# Altium schematic sheet VoltageReferenceGen.SchDoc
size A
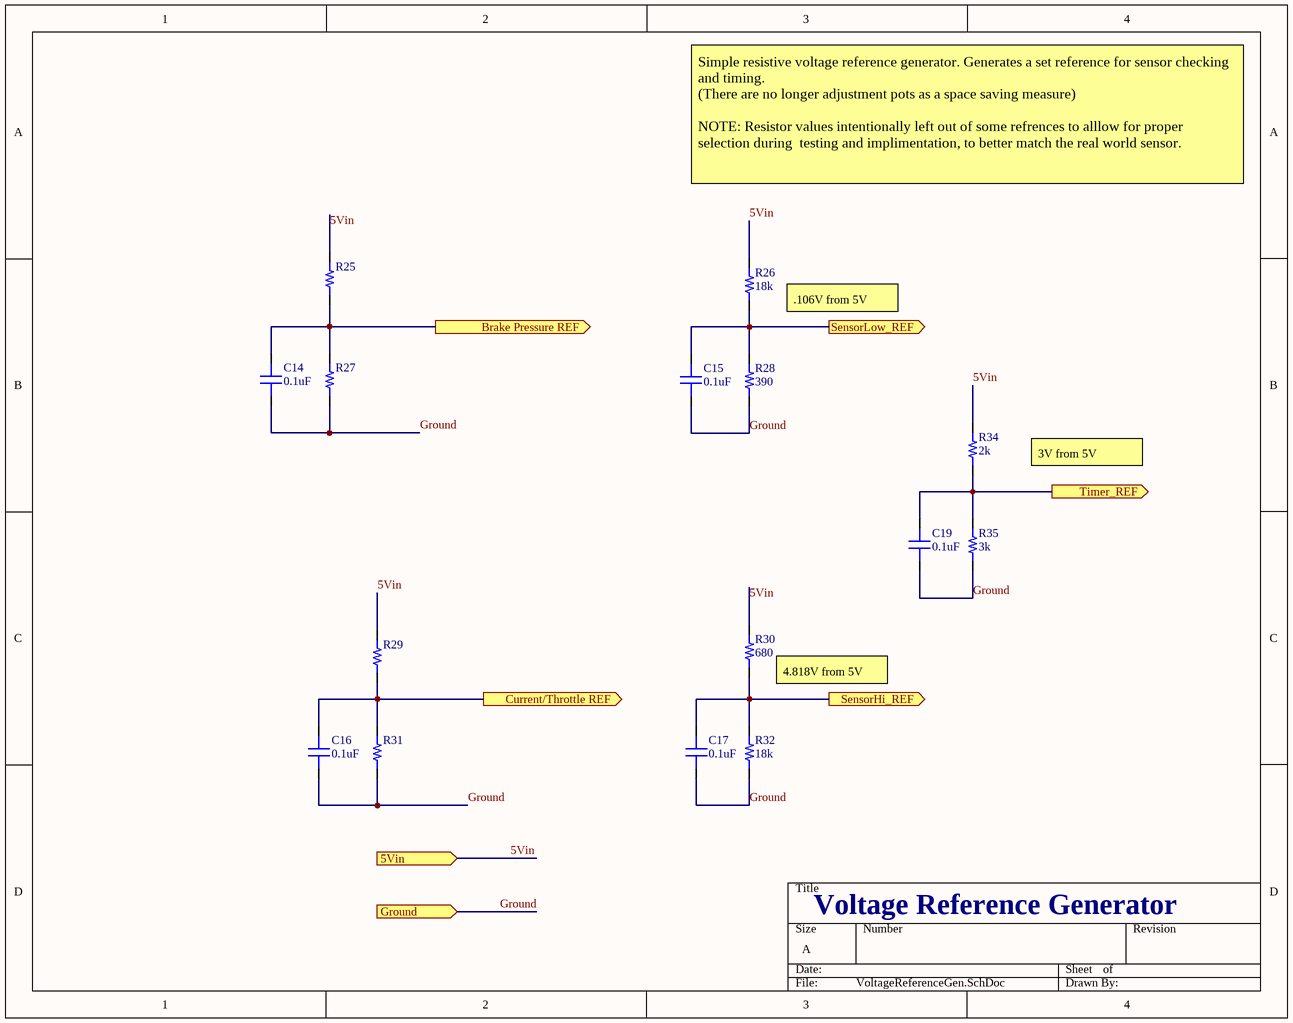
[diagram p0: VoltageReferenceGen.SchDoc]

## Parts
C14  capacitance: 0.1uF  [0603]  (hidden comment: capacitor)
C15  capacitance: 0.1uF  [0603]  (hidden comment: capacitor)
C16  capacitance: 0.1uF  [0603]  (hidden comment: capacitor)
C17  capacitance: 0.1uF  [0603]  (hidden comment: capacitor)
C19  capacitance: 0.1uF  [0603]  (hidden comment: capacitor)
R25  resistor  [RES 0603/1608]  (value not drawn)
R26  resistance: 18k  [RES 0603/1608]  (hidden comment: resistor)
R27  resistor  [RES 0603/1608]  (value not drawn)
R28  resistance: 390  [RES 0603/1608]  (hidden comment: resistor)
R29  resistor  [RES 0603/1608]  (value not drawn)
R30  resistance: 680  [RES 0603/1608]  (hidden comment: resistor)
R31  resistor  [RES 0603/1608]  (value not drawn)
R32  resistance: 18k  [RES 0603/1608]  (hidden comment: resistor)
R34  resistance: 2k  [RES 0603/1608]  (hidden comment: resistor)
R35  resistance: 3k  [RES 0603/1608]  (hidden comment: resistor)

## Ports
5Vin (in), Brake Pressure REF (out), Current/Throttle REF (out), Ground (in), SensorHi_REF (out), SensorLow_REF (out), Timer_REF (out)

## Nets
5Vin: R25.1 R26.1 R29.1 R30.1 R34.1 ; port 5Vin
Brake Pressure REF: C14.2 R25.2 R27.1 ; port Brake Pressure REF
Current/Throttle REF: C16.2 R29.2 R31.1 ; port Current/Throttle REF
Ground: C14.1 C15.1 C16.1 C17.1 C19.1 R27.2 R28.2 R31.2 R32.2 R35.2 ; port Ground
SensorHi_REF: C17.2 R30.2 R32.1 ; port SensorHi_REF
SensorLow_REF: C15.2 R26.2 R28.1 ; port SensorLow_REF
Timer_REF: C19.2 R34.2 R35.1 ; port Timer_REF

## Notes on the sheet
- Simple resistive voltage reference generator. Generates a set reference for sensor checking and timing.
  (There are no longer adjustment pots as a space saving measure)
  NOTE: Resistor values intentionally left out of some refrences to alllow for proper selection during  testing and implimentation, to better match the real world sensor.
- (near R26) .106V from 5V
- 3V from 5V
- (near R30) 4.818V from 5V
- Voltage Reference Generator

## Library data of the parts
C14-C17 C19 = 1: Generic 0603 capacitor; id: 1; voltage: 50; dielectric: Ceramic; percent tolerance: 10; Name: 0603 Capacitor; ESR: 1; package: 0603; quantity: 0
R25-R32 R34 R35 = 1: id: 1; name: 0603 Resistor; percent tolerance: 5; package: 0603; quantity: 0